# Altium project BQ25895_BMS_Module.PrjPcb
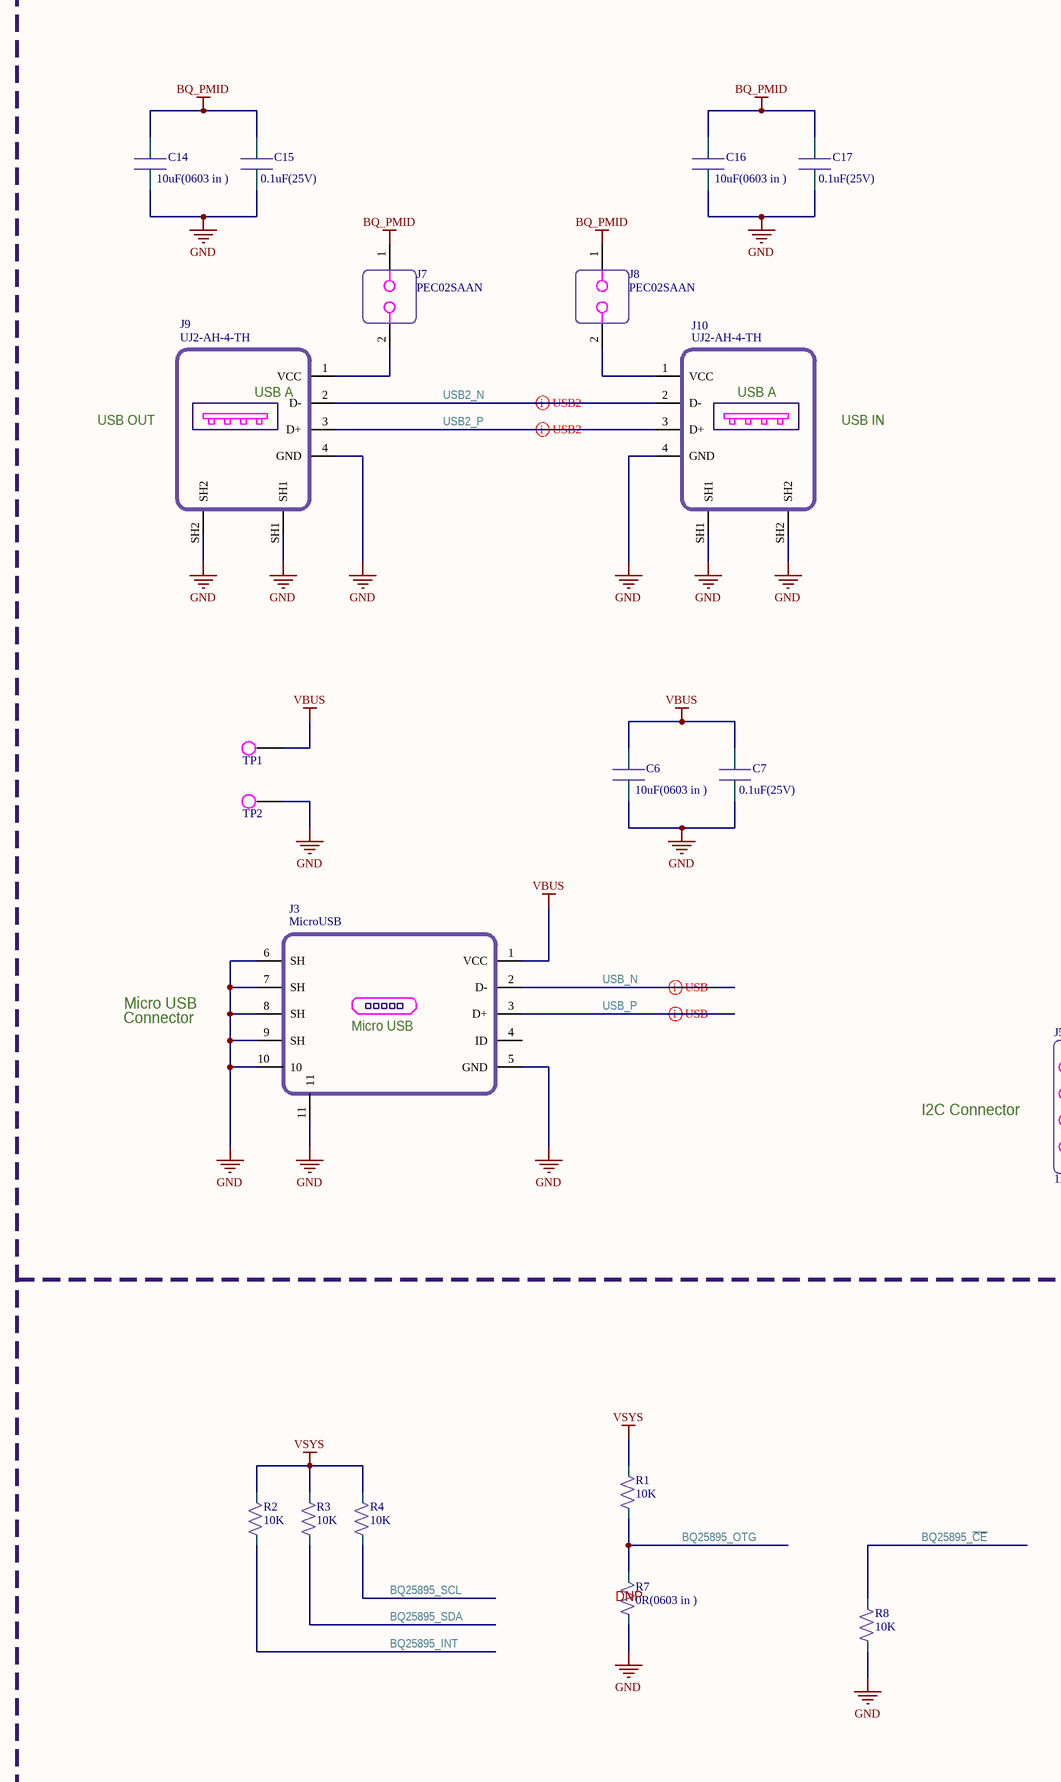
[diagram p0: BQ25895_BMS_Module.SchDoc, left]
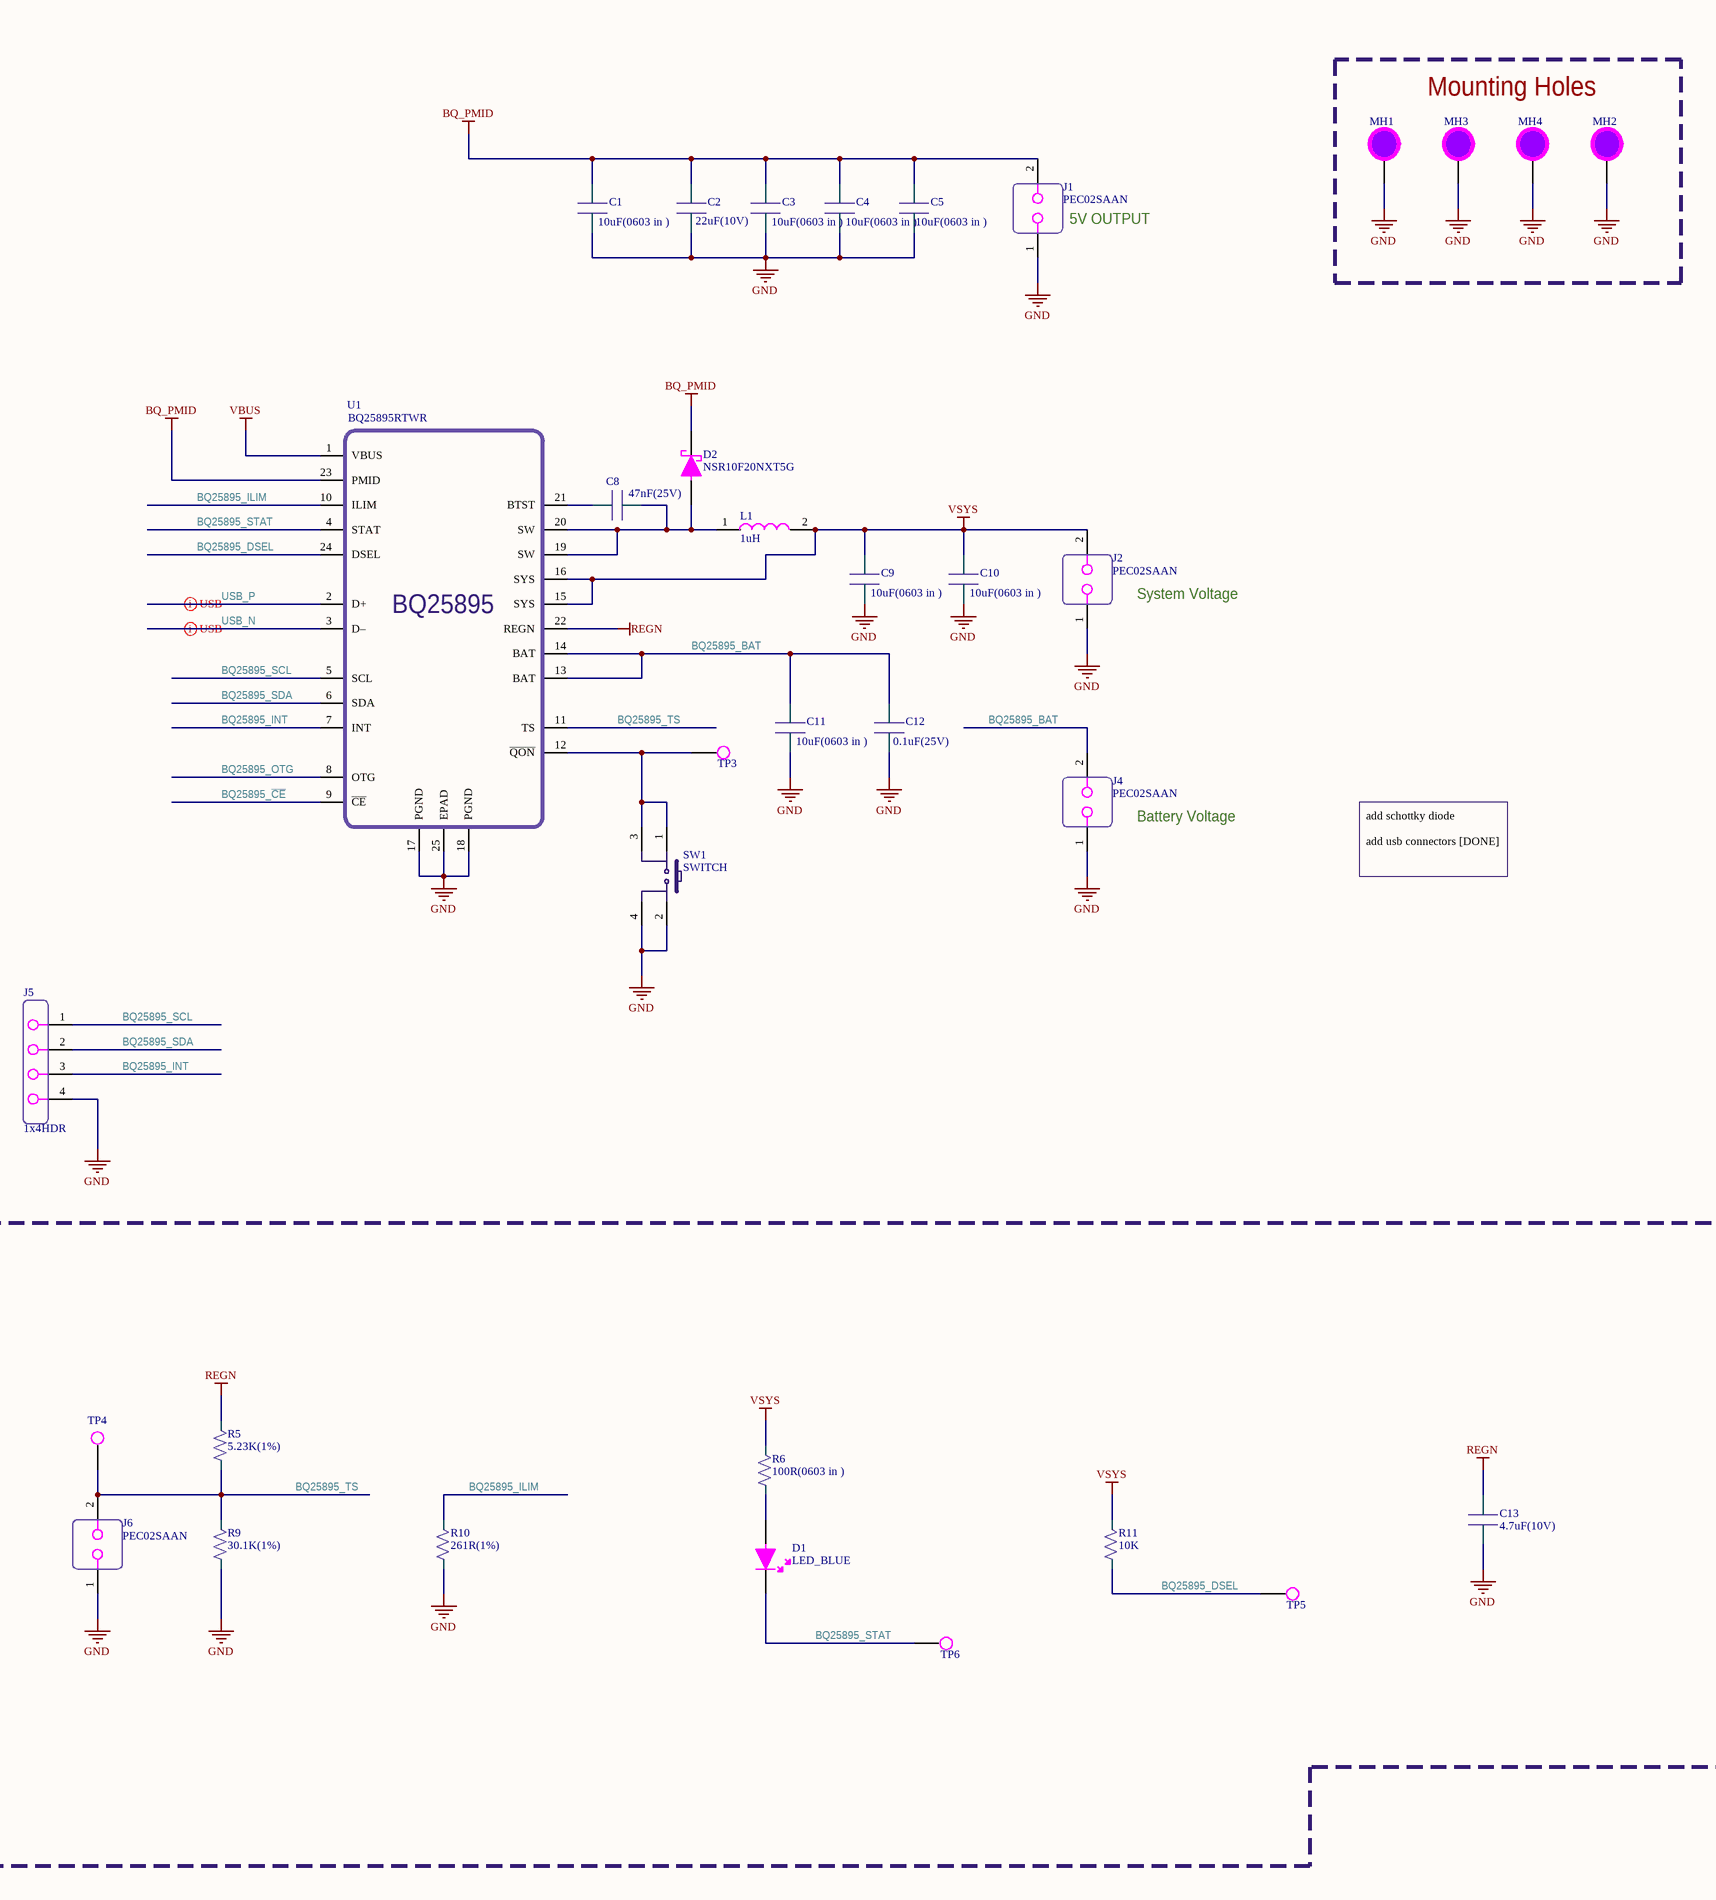
[diagram p1: BQ25895_BMS_Module.SchDoc, right]
1 sheet, 53 parts. Net scope: global (net labels, ports and power ports of the same name join across sheets).
Board file: BQ25895_BMS_Module.PcbDoc

## Sheet BQ25895_BMS_Module.SchDoc: BQ25895 BMS Module
size A2; SheetNumber: 1; SheetTotal: 1

### Parts
C1  10uF(0603 in )  [Capacitor_0603]
C2  22uF(10V)  [Capacitor_0805]
C3  10uF(0603 in )  [Capacitor_0603]
C4  10uF(0603 in )  [Capacitor_0603]
C5  10uF(0603 in )  [Capacitor_0603]
C6  10uF(0603 in )  [Capacitor_0603]
C7  0.1uF(25V)  [Capacitor_0603]
C8  47nF(25V)  [Capacitor_0603]
C9  10uF(0603 in )  [Capacitor_0603]
C10  10uF(0603 in )  [Capacitor_0603]
C11  10uF(0603 in )  [Capacitor_0603]
C12  0.1uF(25V)  [Capacitor_0603]
C13  4.7uF(10V)  [Capacitor_0603]
C14  10uF(0603 in )  [Capacitor_0603]
C15  0.1uF(25V)  [Capacitor_0603]
C16  10uF(0603 in )  [Capacitor_0603]
C17  0.1uF(25V)  [Capacitor_0603]
D1  LED_BLUE  [0603_LED]
D2  NSR10F20NXT5G  [NSR10F20NXT5G]
J1  PEC02SAAN  [P2.541X2HDR]
J2  PEC02SAAN  [P2.541X2HDR]
J3  MicroUSB  [Micro USB]
J4  PEC02SAAN  [P2.541X2HDR]
J5  1x4HDR  [P2.541X4HDR]
J6  PEC02SAAN  [P2.541X2HDR]
J7  PEC02SAAN  [P2.541X2HDR]
J8  PEC02SAAN  [P2.541X2HDR]
J9  UJ2-AH-4-TH  [CUI_UJ2-AH-4-TH]
J10  UJ2-AH-4-TH  [CUI_UJ2-AH-4-TH]
L1  1uH  [VLS6045EX-1R0N]
MH1  Mounting Hole  [Mounting_Hole_3.3mm]  (value not drawn)
MH2  Mounting Hole  [Mounting_Hole_3.3mm]  (value not drawn)
MH3  Mounting Hole  [Mounting_Hole_3.3mm]  (value not drawn)
MH4  Mounting Hole  [Mounting_Hole_3.3mm]  (value not drawn)
R1  10K  [RESISTOR0603]
R2  10K  [RESISTOR0603]
R3  10K  [RESISTOR0603]
R4  10K  [RESISTOR0603]
R5  5.23K(1%)  [RESISTOR0603]
R6  100R(0603 in )  [RESISTOR0603]
R7  0R(0603 in )  [RESISTOR0603]
R8  10K  [RESISTOR0603]
R9  30.1K(1%)  [RESISTOR0603]
R10  261R(1%)  [RESISTOR0603]
R11  10K  [RESISTOR0603]
SW1  SWITCH  [PushButton nf]
TP1  Test Pad  [TestPoint]  (value not drawn)
TP2  Test Pad  [TestPoint]  (value not drawn)
TP3  Test Pad  [TestPoint]  (value not drawn)
TP4  Test Pad  [TestPoint]  (value not drawn)
TP5  Test Pad  [TestPoint]  (value not drawn)
TP6  Test Pad  [TestPoint]  (value not drawn)
U1  BQ25895RTWR  [24-WQFN]

### Blocks framed on the sheet
Mounting Holes: MH1-MH4

### Nets
BQ_PMID: C1.2 C2.2 C3.2 C4.2 C5.2 C14.2 C15.2 C16.2 C17.2 D2.1 J1.2 J7.1 J8.1 U1.23(PMID)
GND: C1.1 C2.1 C3.1 C4.1 C5.1 C6.1 C7.1 C9.1 C10.1 C11.1 C12.1 C13.1 C14.1 C15.1 C16.1 C17.1 J1.1 J2.1 J3.5(GND) J3.6(SH) J3.7(SH) J3.8(SH) J3.9(SH) J3.10 J3.11 J4.1 J5.4 J6.1 J9.4(GND) J9.SH1 J9.SH2 J10.4(GND) J10.SH1 J10.SH2 MH1.1 MH2.1 MH3.1 MH4.1 R7.1 R8.1 R9.1 R10.1 SW1.2 SW1.4 TP2.1 U1.17(PGND) U1.18(PGND) U1.25(EPAD)
REGN: C13.2 R5.2 U1.22(REGN)
VBUS: C6.2 C7.2 J3.1(VCC) TP1.1 U1.1(VBUS)
VSYS: C9.2 C10.2 J2.2 L1.2 R1.2 R2.2 R3.2 R4.2 R6.2 R11.2 U1.15(SYS) U1.16(SYS)
BQ25895_BAT: C11.2 C12.2 J4.2 U1.13(BAT) U1.14(BAT)
BQ25895_~{CE}: R8.2 U1.9(~{CE})
BQ25895_DSEL: R11.1 TP5.1 U1.24(DSEL)
BQ25895_ILIM: R10.2 U1.10(ILIM)
BQ25895_INT: J5.3 R2.1 U1.7(INT)
BQ25895_OTG: R1.1 R7.2 U1.8(OTG)
BQ25895_SCL: J5.1 R4.1 U1.5(SCL)
BQ25895_SDA: J5.2 R3.1 U1.6(SDA)
BQ25895_STAT: D1.2 TP6.1 U1.4(STAT)
BQ25895_TS: J6.2 R5.1 R9.2 TP4.1 U1.11(TS)
USB2_N: J9.2(D-) J10.2(D-)
USB2_P: J9.3(D+) J10.3(D+)
USB_N: J3.2(D-) U1.3(D–)
USB_P: J3.3(D+) U1.2(D+)
NetC8_1: C8.1 U1.21(BTST)
NetC8_2: C8.2 D2.2 L1.1 U1.19(SW) U1.20(SW)
NetD1_1: D1.1 R6.1
NetJ7_2: J7.2 J9.1(VCC)
NetJ8_2: J8.2 J10.1(VCC)
NetSW1_1: SW1.1 SW1.3 TP3.1 U1.12(~{QON})

Not connected (* = marked no-connect by the designer): J3 4(ID)

### Layout directives
differential pair: USB2_N, USB2_P, USB_N, USB_P

### Notes on the sheet
- (near J1) 5V OUTPUT
- USB OUT
- (near J10) USB IN
- (near J2) System Voltage
- (near J4) Battery Voltage
- add schottky diode
  add usb connectors [DONE]
- Connector
- Micro USB
- (near J5) I2C Connector
- (near R7) DNP
- (in symbol 629105150521) Micro USB
- (in symbol BQ25895RTWR) BQ25895
- (in symbol UJ2-AH-4-TH) USB A

### Library data of the parts
C1 C3-C6 C9-C11 C14 C16 = GRM188R61E106KA73D: 10µF ±10% 25V Ceramic Capacitor X5R 0603 (1608 Metric); Manufacturer: Murata Electronics; MinTemp: -55°C; MaxTemp: 85°C; ManufacturerPartNumber: GRM188R61E106KA73D; SupplierPartNumber: 490-18214-1-ND; PartStatus: Active; Price: 0.32; ComponentLink1Description: SupplierURL; ComponentLink1URL: https://www.digikey.com/en/products/detail/murata-electronics/GRM188R61E106KA73D/9867922; Supplier: Digikey
C2 = CL21A226KPCLRNC: 22 µF ±10% 10V Ceramic Capacitor X5R 0805 (2012 Metric); Manufacturer: Samsung Electro-Mechanics; MinTemp: -55°C; MaxTemp: 85°C; ManufacturerPartNumber: CL21A226KPCLRNC; SupplierPartNumber: 1276-6786-1-ND; Supplier: Digikey; PartStatus: Active; Price: 0.39; ComponentLink1Description: SupplierURL; ComponentLink1URL: https://www.digikey.in/en/products/detail/samsung-electro-mechanics/CL21A226KPCLRNC/5961270
C7 C12 C15 C17 = C0603C104J3RAC7411: ±5% 25V Ceramic Capacitor X7R 0603 (1608 Metric); Manufacturer: KEMET; MinTemp: -55°C; MaxTemp: 125°C; ManufacturerPartNumber: C0603C104J3RAC7411; SupplierPartNumber: 399-C0603C104J3RAC7411CT-ND; Supplier: Digikey; PartStatus: Active; Price: 0.43; ComponentLink1Description: SupplierURL; ComponentLink1URL: https://www.digikey.com/en/products/detail/kemet/C0603C104J3RAC7411/12701256
C8 = C0603C473J3RACAUTO: 0.047 µF ±5% 25V Ceramic Capacitor X7R 0603 (1608 Metric); Manufacturer: KEMET; MinTemp: -55C; MaxTemp: 125C; ManufacturerPartNumber: C0603C473J3RACAUTO; SupplierPartNumber: 399-6897-1-ND; Supplier: Digikey; PartStatus: Active; Price: 0.18; ComponentLink1Description: SupplierURL; ComponentLink1URL: https://www.digikey.in/en/products/detail/kemet/C0603C473J3RACAUTO/3314892
C13 = 0603ZD475KAT2A: 4.7 µF ±10% 10V Ceramic Capacitor X5R 0603 (1608 Metric); Manufacturer: KYOCERA AVX; MinTemp: -55C; MaxTemp: 85C; ManufacturerPartNumber: 0603ZD475KAT2A; SupplierPartNumber: 478-7943-1-ND; Supplier: Digikey; PartStatus: Active; Price: 0.81; ComponentLink1Description: SupplierURL; ComponentLink1URL: https://www.digikey.in/en/products/detail/kyocera-avx/0603ZD475KAT2A/3080849
D1 = BHC-ZL1M2RY/3T: Blue 465~475nm 0603 Light Emitting Diodes (LED) ROHS; Manufacturer: Everlight Elec; MinTemp: -40C; MaxTemp: 85C; ManufacturerPartNumber: BHC-ZL1M2RY/3T; SupplierPartNumber: C131231; Supplier: LCSC; Price: 0.57; ComponentLink1Description: SupplierURL; ComponentLink1URL: https://lcsc.com/product-detail/Light-Emitting-Diodes-LED_Everlight-Elec-19-213-BHC-ZL1M2RY-3T_C131231.html
D2 = NSR10F20NXT5G: Diode Schottky 20 V 1A (DC) Surface Mount 2-DSN (1.4x0.6); Manufacturer: ON Semiconductor; MaxTemp: +150°C; ManufacturerPartNumber: NSR10F20NXT5G; SupplierPartNumber: NSR10F20NXT5GOSCT-ND; Supplier: Digikey; PartStatus: Active; MinTemp: *; Price: 0.51; ComponentLink1Description: SupplierURL; ComponentLink1URL: https://www.digikey.com/en/products/detail/on-semiconductor/NSR10F20NXT5G/2401415
J1 J2 J4 J6-J8 = PEC02SAAN: Connector Header Through Hole 2 position 0.100" (2.54mm); Min Temp: -65°C; Max Temp: 125°C; Manyfacturer Part Number: PEC02SAAN; Supplier Part Number: S1012E-02-ND; Part Status: Active; Price: 0.18; ComponentLink1Description: Supplier Link; ComponentLink1URL: https://www.digikey.com/en/products/detail/sullins-connector-solutions/PEC02SAAN/859155
J3 = 629105150521: USB - micro B USB 2.0 Receptacle Connector 5 Position Surface Mount, Right Angle; Through Hole; Manufacturer: Würth Elektronik; MinTemp: -40°C; MaxTemp: 85°C; ManufacturerPartNumber: 629105150521; SupplierPartNumber: 732-5960-1-ND; Supplier: Digikey; PartStatus: Active; Price: 2.07; ComponentLink1Description: SupplierURL; ComponentLink1URL: https://www.digikey.com/en/products/detail/würth-elektronik/629105150521/5047751; ClassName: USBconnector
J5 = PEC04SAAN: Connector Header Through Hole 4 position 0.100" (2.54mm); Maanufacturer: Sullins Connector Solutions; MinTemp: -65°C; MaxTemp: 125°C; ManufacturerPartNumber: PEC04SAAN; SupplierPartNumber: S1012E-04-ND; Supplier: Digikey; PartStatus: Active; Price: 0.27; ComponentLink1Description: SupplierURL; ComponentLink1URL: https://www.digikey.com/en/products/detail/sullins-connector-solutions/PEC04SAAN/859157
J9 J10 = UJ2-AH-4-TH: USB-A (USB TYPE-A) USB 2.0 Receptacle Connector 4 Position Through Hole, Right Angle; Manufacturer: CUI Devices; MinTemp: -20C; MaxTemp: 85C; ManufacturerPartNumber: UJ2-AH-4-TH; SupplierPartNumber: 102-3994-ND; Supplier: Digikey; PartStatus: Active; Price: 0.97; ComponentLink1Description: SupplierURL; ComponentLink1URL: https://www.digikey.in/en/products/detail/cui-devices/UJ2-AH-4-TH/6187909
L1 = VLS6045EX-1R0N: FIXED IND 1UH 6A 16 MOHM SMD; Manufacturer: TDK Corporation; MinTemp: -40C; MaxTemp: 105C; ManufacturerPartNumber: VLS6045EX-1R0N; SupplierPartNumber: 445-173043-1-ND; Supplier: Digikey; PartStatus: Active; Price: 0.51; ComponentLink1Description: SupplierURL; ComponentLink1URL: https://www.digikey.in/en/products/detail/tdk-corporation/VLS6045EX-1R0N/5286692
MH1-MH4 = 3MM_MOUNTING_HOLE: 3.3mm Mounting Hole; ClassName: Mounting Hole
R1-R4 R8 R11 = RMCF0603JT10K0: 10 kOhms ±5% 0.1W, 1/10W Chip Resistor 0603 (1608 Metric) Automotive AEC-Q200 Thick Film; Manufacturer: Stackpole Electronics Inc; MinTemp: -55°C; MaxTemp: 155°C; ManufacturerPartNumber: RMCF0603JT10K0; SupplierPartNumber: RMCF0603JT10K0CT-ND; Supplier: Digikey; PartStatus: Active; Price: 0.10; ComponentLink1Description: SupplierURL; ComponentLink1URL: https://www.digikey.com/en/products/detail/stackpole-electronics-inc/RMCF0603JT10K0/1758104
R5 = RMCF0603FT5K23: 5.23 kOhms ±1% 0.1W, 1/10W Chip Resistor 0603 (1608 Metric) Automotive AEC-Q200 Thick Film; Manufacturer: Stackpole Electronics Inc; MinTemp: -55C; MaxTemp: 155C; ManufacturerPartNumber: RMCF0603FT5K23; SupplierPartNumber: RMCF0603FT5K23CT-ND; Supplier: Digikey; PartStatus: Active; Price: 0.10; ComponentLink1Description: SupplierURL; ComponentLink1URL: https://www.digikey.in/en/products/detail/stackpole-electronics-inc/RMCF0603FT5K23/1760913
R6 = CRCW0603100RJNEAC: 100 Ohms ±5% 0.1W, 1/10W Chip Resistor 0603 (1608 Metric)  Thick Film; Min Temp: -55°C; Max Temp: 155°C; Manufacturer Part Number: CRCW0603100RJNEAC; Supplier Part Number: 541-4059-1-ND; Part Status: Active; Price: 0.10; ComponentLink1Description: Supplier Link; ComponentLink1URL: https://www.digikey.com/en/products/detail/vishay-dale/CRCW0603100RJNEAC/7928481
R7 = SR1-0603-000: 0 Ohms ±5% 0.063W, 1/16W Chip Resistor 0603 (1608 Metric)  Thick Film; Min Temp: -55°C; Max Temp: 155°C; Manufacturer Part Number: SR1-0603-000; Supplier Part Number: 2368-SR1-0603-000-ND; Part Status: Active; Price: 0.02000; ComponentLink1Description: Supplier Link; ComponentLink1URL: https://www.digikey.com/en/products/detail/nte-electronics-inc/SR1-0603-000/11644791
R9 = RMCF0603FG30K1: 30.1 kOhms ±1% 0.1W, 1/10W Chip Resistor 0603 (1608 Metric) Automotive AEC-Q200 Thick Film; Manufacturer: Stackpole Electronics Inc; MinTemp: -55°C; MaxTemp: 155°C; ManufacturerPartNumber: RMCF0603FG30K1; SupplierPartNumber: RMCF0603FG30K1CT-ND; Supplier: DIgikey; PartStatus: Active; Price: 0.10; ComponentLink1Description: SupplierURL; ComponentLink1URL: https://www.digikey.in/en/products/detail/stackpole-electronics-inc/RMCF0603FG30K1/1713912
R10 = ERJ-PA3F2610V: Thick Film Resistors 0603 261ohm 1% Anti-Surge AEC-Q200; Manufacturer: Panasonic; MinTemp: - 55 C; MaxTemp: + 155 C; ManufacturerPartNumber: ERJ-PA3F2610V; SupplierPartNumber: 667-ERJ-PA3F2610V; Supplier: Digikey; PartStatus: Active; Price: 11.20(INR); ComponentLink1Description: SupplierURL; ComponentLink1URL: https://www.mouser.in/ProductDetail/Panasonic/ERJ-PA3F2610V?qs=BzJM0faLVqWOtl0KpXWkew%3D%3D
SW1 = TL1105DF160Q: Tactile Switch SPST-NO Top Actuated Surface Mount; Manufacturer: E-Switch; MinTemp: -20°C; MaxTemp: 70°C; ManufacturerPartNumber: TL1105DF160Q; SupplierPartNumber: EG1865-ND; Supplier: Digikey; PartStatus: Active; Price: 0.17; ComponentLink1Description: SupplierURL; ComponentLink1URL: https://www.digikey.com/en/products/detail/e-switch/TL1105DF160Q/271562
TP1-TP6 = TestPoint: 2mm Diameter test point; Manufacturer Part Number: *; Supplier Part Number: *; Part Status: *; Min Temp: *; Max Temp: *; Price: *; ComponentLink1Description: Supplier Link; ComponentLink1URL: *
U1 = BQ25895RTWR: Charger IC Lithium Ion/Polymer 24-WQFN (4x4); Manufacturer: Texas Instruments; MinTemp: -40°C; MaxTemp: 85°C; ManufacturerPartNumber: BQ25895RTWR; SupplierPartNumber: 296-44345-1-ND; Supplier: Digikey; PartStatus: Active; Price: 3.46; ComponentLink1Description: SupplierURL; ComponentLink1URL: https://www.digikey.com/en/products/detail/texas-instruments/BQ25895RTWR/5214018